# Altium schematic sheet FPGA1.SchDoc: Cypress Molson - FPGA1
size C; DrawnBy: G. Cosens; Engineer: G. Cosens; Organization: Linear Systems Ltd.; Address1: 1-1717 Dublin Ave.; Address2: Winnipeg, MB, Canada; Address3: R3H 0H2; DocumentNumber: LS7652; Revision: 1; SheetNumber: 04; SheetTotal: 12
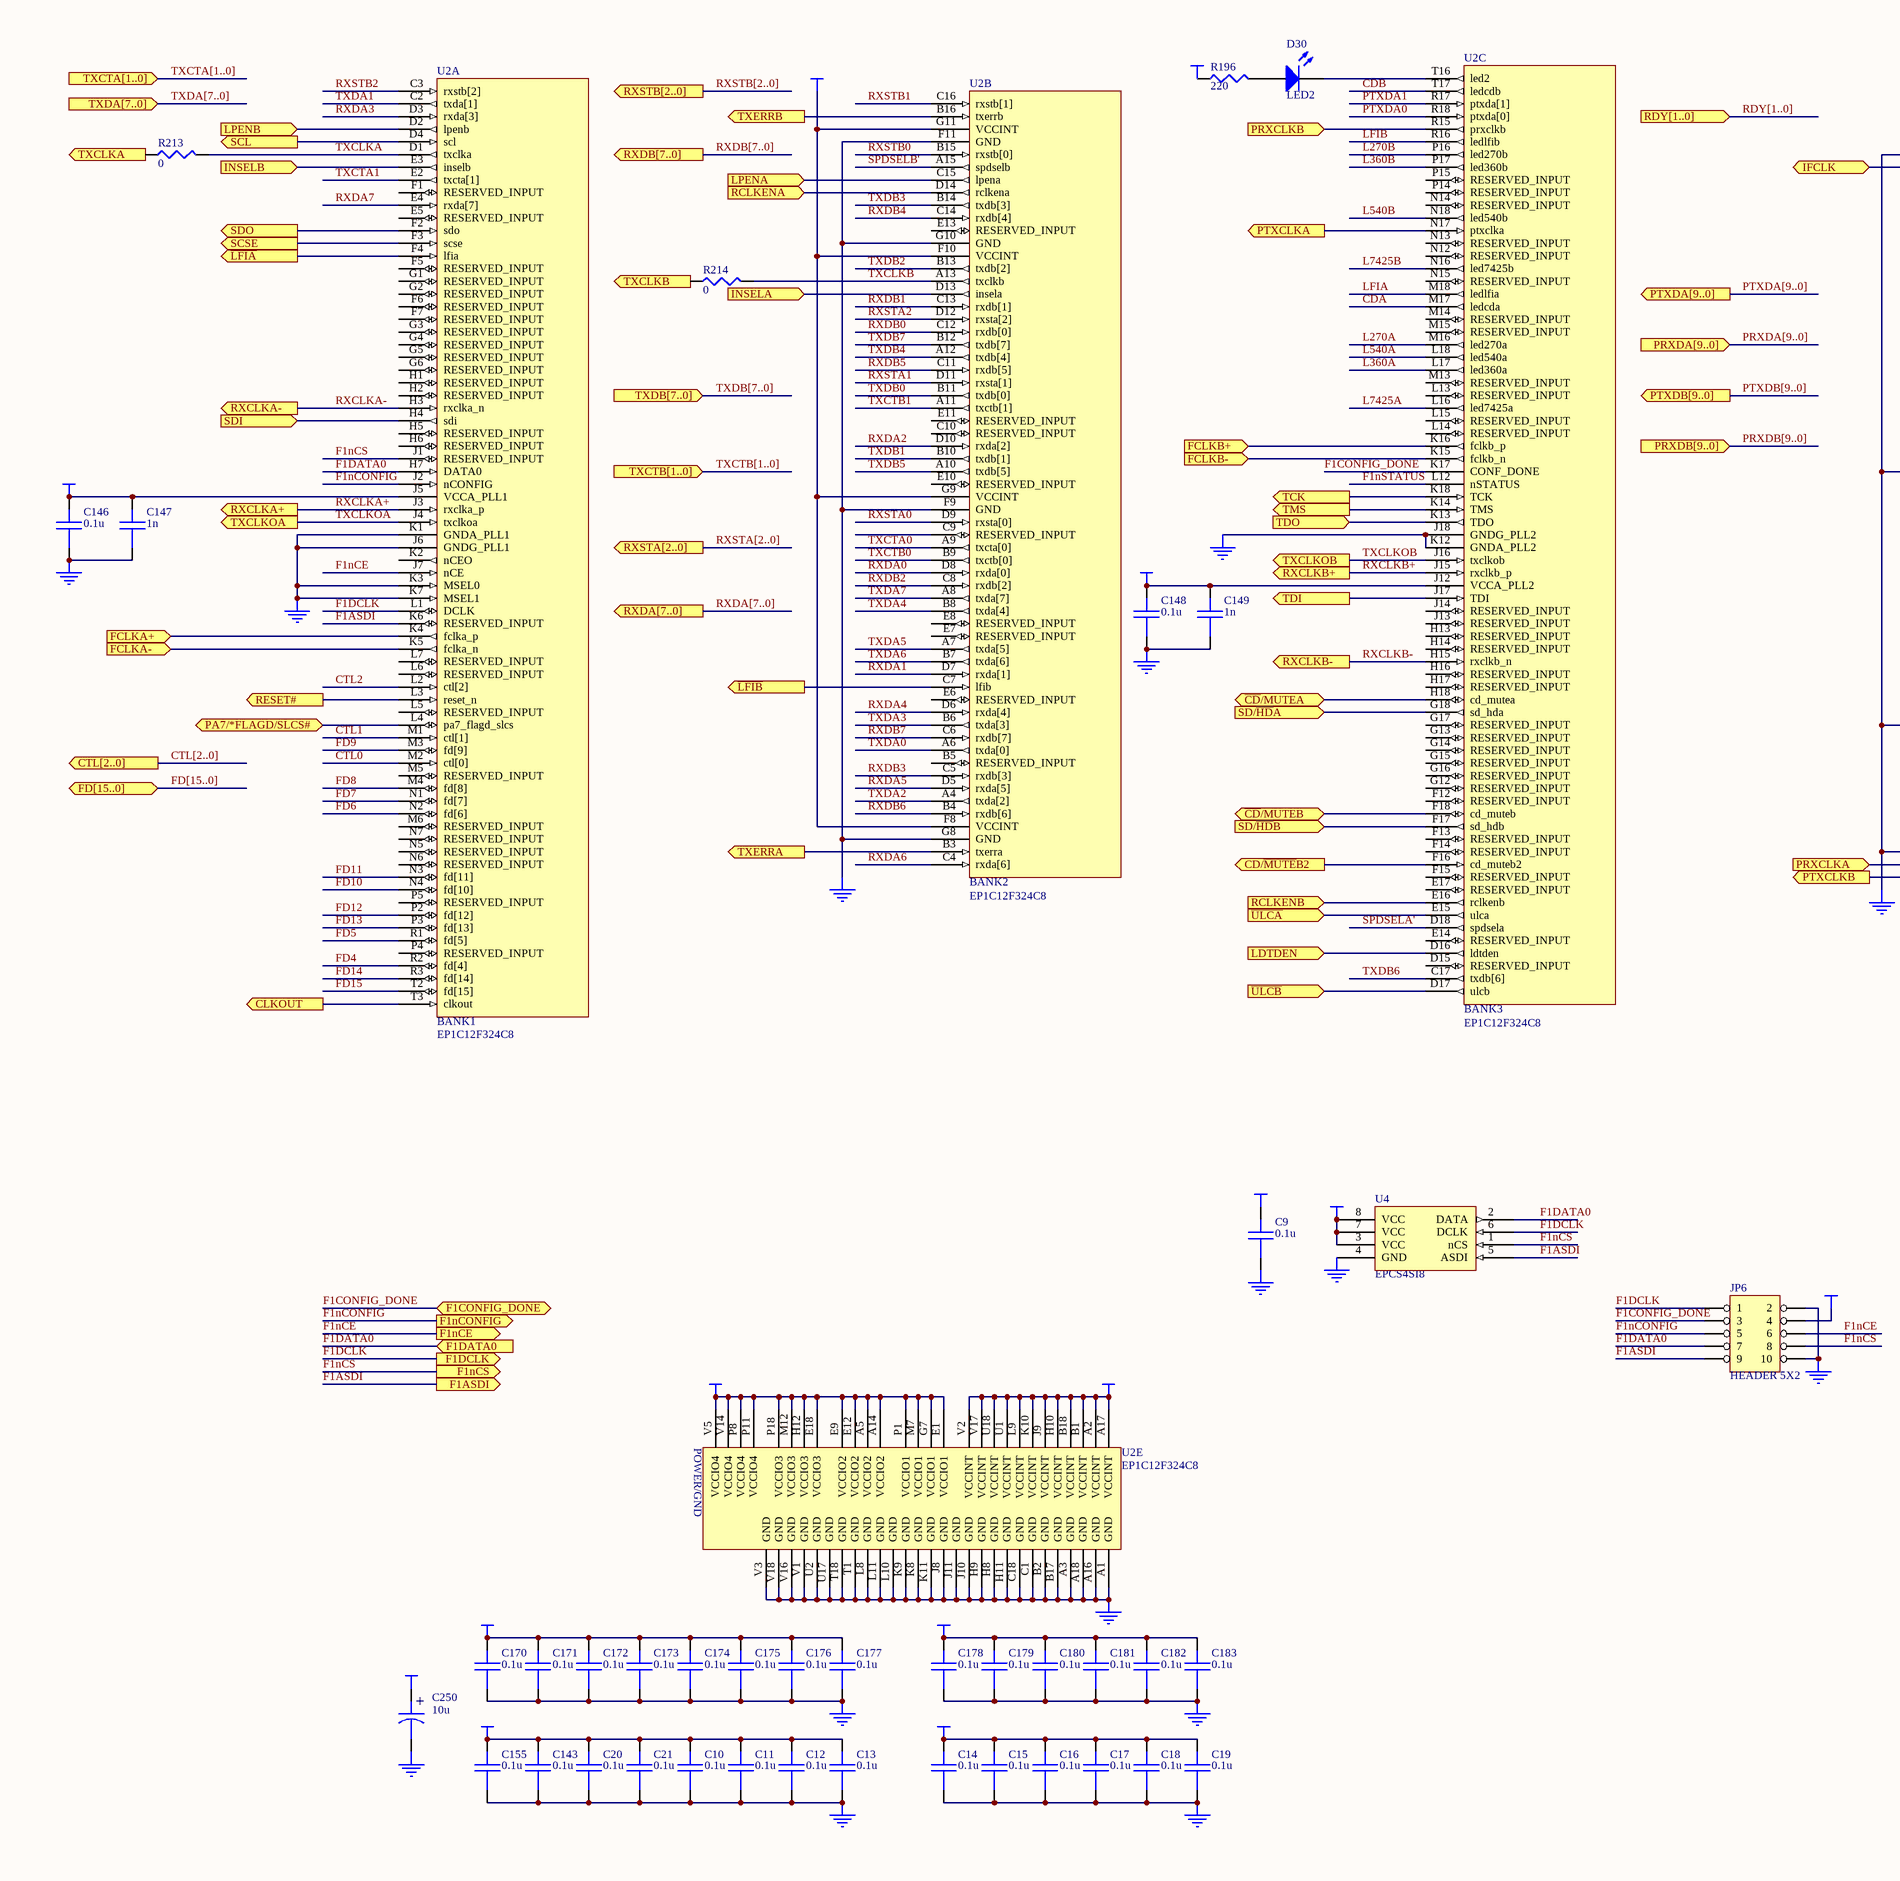
[diagram p0: FPGA1.SchDoc, left]
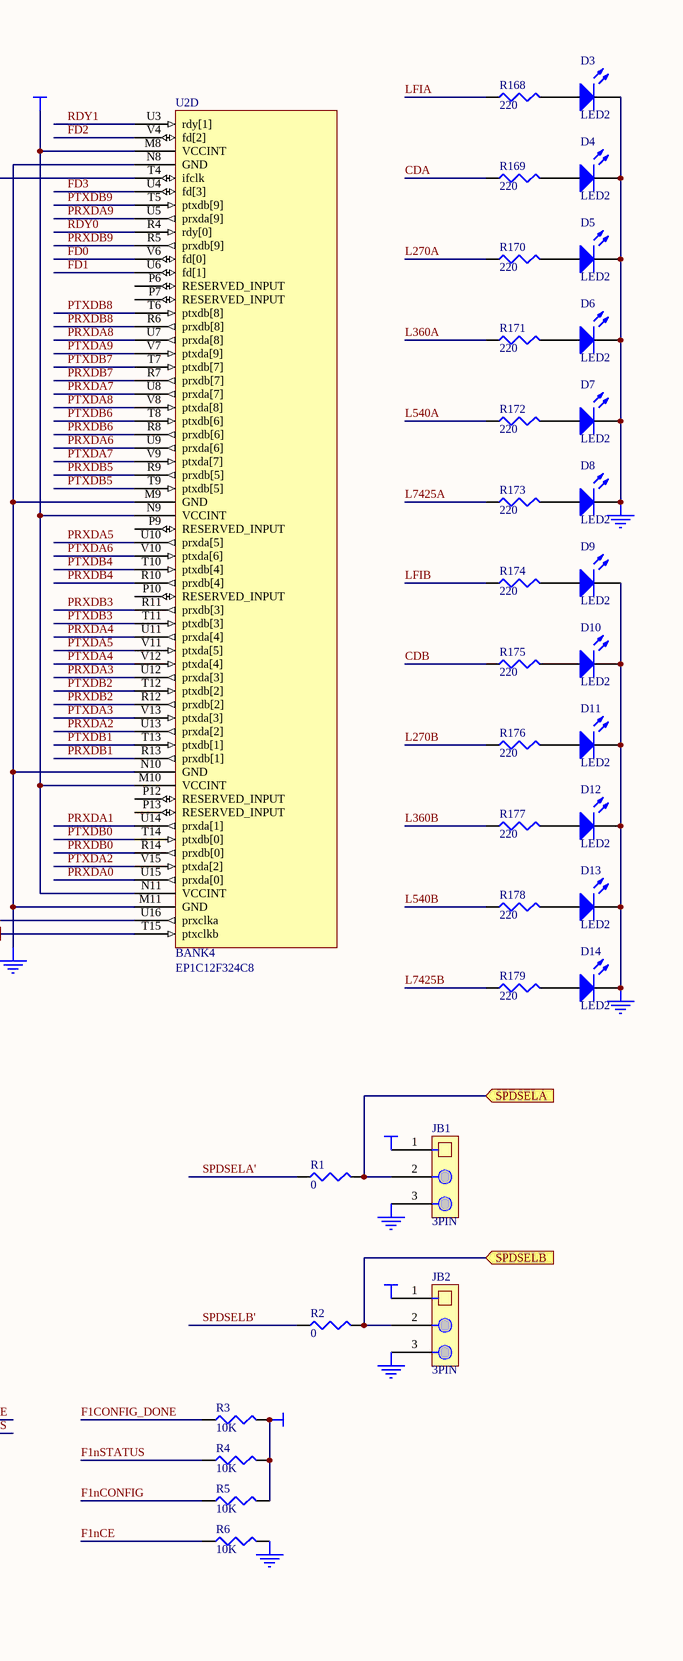
[diagram p1: FPGA1.SchDoc, right]

## Parts
C9  (no value)  [0603]
C10  (no value)  [0603]
C11  (no value)  [0603]
C12  (no value)  [0603]
C13  (no value)  [0603]
C14  (no value)  [0603]
C15  (no value)  [0603]
C16  (no value)  [0603]
C17  (no value)  [0603]
C18  (no value)  [0603]
C19  (no value)  [0603]
C20  (no value)  [0603]
C21  (no value)  [0603]
C143  (no value)  [0603]
C146  (no value)  [0603]
C147  (no value)  [0603]
C148  (no value)  [0603]
C149  (no value)  [0603]
C155  (no value)  [0603]
C170  (no value)  [0603]
C171  (no value)  [0603]
C172  (no value)  [0603]
C173  (no value)  [0603]
C174  (no value)  [0603]
C175  (no value)  [0603]
C176  (no value)  [0603]
C177  (no value)  [0603]
C178  (no value)  [0603]
C179  (no value)  [0603]
C180  (no value)  [0603]
C181  (no value)  [0603]
C182  (no value)  [0603]
C183  (no value)  [0603]
C250  10u  [6032]
D3  LED2  [0603D]
D4  LED2  [0603D]
D5  LED2  [0603D]
D6  LED2  [0603D]
D7  LED2  [0603D]
D8  LED2  [0603D]
D9  LED2  [0603D]
D10  LED2  [0603D]
D11  LED2  [0603D]
D12  LED2  [0603D]
D13  LED2  [0603D]
D14  LED2  [0603D]
D30  LED2  [0603D]
JB1  3PIN  [3X1PIN]
JB2  3PIN  [3X1PIN]
JP6  (no value)  [2X5PIN]
R1  0  [0603]
R2  0  [0603]
R3  10K  [0603]
R4  10K  [0603]
R5  10K  [0603]
R6  10K  [0603]
R168  220  [0603]
R169  220  [0603]
R170  220  [0603]
R171  220  [0603]
R172  220  [0603]
R173  220  [0603]
R174  220  [0603]
R175  220  [0603]
R176  220  [0603]
R177  220  [0603]
R178  220  [0603]
R179  220  [0603]
R196  220  [0603]
R213  0  [0603]
R214  0  [0603]
U2  EP1C12F324C8  [BGA19X19-B324]  (parts A,B,C,D,E of 5)
U4  (no value)  [SO-8]

## Ports
CD/~{MUTE}B2 (out), CLKOUT (out), CTL[2..0] (out), F1ASDI (out), F1CONFIG_DONE (bidir), F1DATA0 (in), F1DCLK (out), F1nCE (out), F1nCONFIG (out), F1nCS (out), FCLKA+ (in), FCLKA- (in), FCLKB+ (in), FCLKB- (in), FD[15..0] (bidir), IFCLK (bidir), INSELA (in), INSELB (in), LDTDEN (in), LPENA (in), LPENB (in), PA7/*FLAGD/SLCS# (bidir), PRXCLKA (in), PRXCLKB (in), PRXDA[9..0] (in), PRXDB[9..0] (in), PTXCLKA (out), PTXCLKB (out), PTXDA[9..0] (out), PTXDB[9..0] (out), RCLKENA (in), RCLKENB (in), RDY[1..0] (in), RESET# (out), RXCLKA+ (out), RXCLKA- (out), RXCLKB+ (out), RXCLKB- (out), RXDA[7..0] (out), RXDB[7..0] (out), RXSTA[2..0] (out), RXSTB[2..0] (out), SCL (out), SCSE (out), SD/~{HD}A (in), SD/~{HD}B (in), SDI (in), SDO (out), SPDSELA (in), SPDSELB (in), TCK (out), TDI (out), TDO (in), TMS (out), TXCLKA (in), TXCLKB (in), TXCLKOA (out), TXCLKOB (out), TXCTA[1..0] (in), TXCTB[1..0] (in), TXDA[7..0] (in), TXDB[7..0] (in), TXERRA (out), TXERRB (out), ~{CD}/MUTEA (bidir), ~{CD}/MUTEB (bidir), ~{LFIA} (out), ~{LFIB} (out), ~{ULCA} (in), ~{ULCB} (in)

## Nets
+1.5V: C14.1 C15.1 C16.1 C17.1 C18.1 C19.1 C178.1 C179.1 C180.1 C181.1 C182.1 C183.1 U2.A2(VCCINT) U2.A17(VCCINT) U2.B1(VCCINT) U2.B18(VCCINT) U2.F8(VCCINT) U2.F10(VCCINT) U2.G9(VCCINT) U2.G11(VCCINT) U2.H10(VCCINT) U2.J9(VCCINT) U2.K10(VCCINT) U2.L9(VCCINT) U2.M8(VCCINT) U2.M10(VCCINT) U2.N9(VCCINT) U2.N11(VCCINT) U2.U1(VCCINT) U2.U18(VCCINT) U2.V2(VCCINT) U2.V17(VCCINT)
+1.5VA: C146.1 C147.1 C148.1 C149.1 U2.J5(VCCA_PLL1) U2.J12(VCCA_PLL2)
+3.3V: C9.1 C10.1 C11.1 C12.1 C13.1 C20.1 C21.1 C143.1 C155.1 C170.1 C171.1 C172.1 C173.1 C174.1 C175.1 C176.1 C177.1 C250.1 JB1.1 JB2.1 JP6.4 R3.2 R4.2 R5.2 R196.1 U2.A5(VCCIO2) U2.A14(VCCIO2) U2.E1(VCCIO1) U2.E9(VCCIO2) U2.E12(VCCIO2) U2.E18(VCCIO3) U2.G7(VCCIO1) U2.H12(VCCIO3) U2.M7(VCCIO1) U2.M12(VCCIO3) U2.P1(VCCIO1) U2.P8(VCCIO4) U2.P11(VCCIO4) U2.P18(VCCIO3) U2.V5(VCCIO4) U2.V14(VCCIO4) U4.3(VCC) U4.7(VCC) U4.8(VCC)
GND: C9.2 C10.2 C11.2 C12.2 C13.2 C14.2 C15.2 C16.2 C17.2 C18.2 C19.2 C20.2 C21.2 C143.2 C146.2 C147.2 C148.2 C149.2 C155.2 C170.2 C171.2 C172.2 C173.2 C174.2 C175.2 C176.2 C177.2 C178.2 C179.2 C180.2 C181.2 C182.2 C183.2 C250.2 D3.2(K) D4.2(K) D5.2(K) D6.2(K) D7.2(K) D8.2(K) D9.2(K) D10.2(K) D11.2(K) D12.2(K) D13.2(K) D14.2(K) JB1.3 JB2.3 JP6.2 JP6.10 R6.2 U2.A1(GND) U2.A3(GND) U2.A16(GND) U2.A18(GND) U2.B2(GND) U2.B17(GND) U2.C1(GND) U2.C18(GND) U2.F9(GND) U2.F11(GND) U2.G8(GND) U2.G10(GND) U2.H8(GND) U2.H9(GND) U2.H11(GND) U2.J6(GNDG_PLL1) U2.J8(GND) U2.J10(GND) U2.J11(GND) U2.J18(GNDG_PLL2) U2.K1(GNDA_PLL1) U2.K3(MSEL0) U2.K7(MSEL1) U2.K8(GND) U2.K9(GND) U2.K11(GND) U2.K12(GNDA_PLL2) U2.L8(GND) U2.L10(GND) U2.L11(GND) U2.M9(GND) U2.M11(GND) U2.N8(GND) U2.N10(GND) U2.T1(GND) U2.T18(GND) U2.U2(GND) U2.U17(GND) U2.V1(GND) U2.V3(GND) U2.V16(GND) U2.V18(GND) U4.4(GND)
~{CD}/MUTEA: U2.H18(cd_mutea) ; port ~{CD}/MUTEA
~{CD}/MUTEB: U2.F18(cd_muteb) ; port ~{CD}/MUTEB
CD/~{MUTE}B2: U2.F16(cd_muteb2) ; port CD/~{MUTE}B2
CDA: R169.1 U2.M17(ledcda)
CDB: R175.1 U2.T17(ledcdb)
CLKOUT: U2.T3(clkout) ; port CLKOUT
CTL0: U2.M2(ctl[0])
CTL1: U2.M1(ctl[1])
CTL2: U2.L2(ctl[2])
F1ASDI: JP6.9 U2.K6(RESERVED_INPUT) U4.5(ASDI) ; port F1ASDI
F1CONFIG_DONE: JP6.3 R3.1 U2.K17(CONF_DONE) ; port F1CONFIG_DONE
F1DATA0: JP6.7 U2.H7(DATA0) U4.2(DATA) ; port F1DATA0
F1DCLK: JP6.1 U2.L1(DCLK) U4.6(DCLK) ; port F1DCLK
F1nCE: JP6.6 R6.1 U2.J7(nCE) ; port F1nCE
F1nCONFIG: JP6.5 R5.1 U2.J2(nCONFIG) ; port F1nCONFIG
F1nCS: JP6.8 U2.J1(RESERVED_INPUT) U4.1(nCS) ; port F1nCS
F1nSTATUS: R4.1 U2.L12(nSTATUS)
FCLKA+: U2.K4(fclka_p) ; port FCLKA+
FCLKA-: U2.K5(fclka_n) ; port FCLKA-
FCLKB+: U2.K16(fclkb_p) ; port FCLKB+
FCLKB-: U2.K15(fclkb_n) ; port FCLKB-
FD0: U2.V6(fd[0])
FD1: U2.U6(fd[1])
FD2: U2.V4(fd[2])
FD3: U2.U4(fd[3])
FD4: U2.R2(fd[4])
FD5: U2.R1(fd[5])
FD6: U2.N2(fd[6])
FD7: U2.N1(fd[7])
FD8: U2.M4(fd[8])
FD9: U2.M3(fd[9])
FD10: U2.N4(fd[10])
FD11: U2.N3(fd[11])
FD12: U2.P2(fd[12])
FD13: U2.P3(fd[13])
FD14: U2.R3(fd[14])
FD15: U2.T2(fd[15])
IFCLK: U2.T4(ifclk) ; port IFCLK
INSELA: U2.D13(insela) ; port INSELA
INSELB: U2.E3(inselb) ; port INSELB
L270A: R170.1 U2.M16(led270a)
L270B: R176.1 U2.P16(led270b)
L360A: R171.1 U2.L17(led360a)
L360B: R177.1 U2.P17(led360b)
L540A: R172.1 U2.L18(led540a)
L540B: R178.1 U2.N18(led540b)
L7425A: R173.1 U2.L16(led7425a)
L7425B: R179.1 U2.N16(led7425b)
~{LFIA}: U2.F4(lfia) ; port ~{LFIA}
~{LFIB}: U2.C7(lfib) ; port ~{LFIB}
LDTDEN: U2.D16(ldtden) ; port LDTDEN
LFIA: R168.1 U2.M18(ledlfia)
LFIB: R174.1 U2.R16(ledlfib)
LPENA: U2.C15(lpena) ; port LPENA
LPENB: U2.D2(lpenb) ; port LPENB
PA7/*FLAGD/SLCS#: U2.L4(pa7_flagd_slcs) ; port PA7/*FLAGD/SLCS#
PRXCLKA: U2.U16(prxclka) ; port PRXCLKA
PRXCLKB: U2.R15(prxclkb) ; port PRXCLKB
PRXDA0: U2.U15(prxda[0])
PRXDA1: U2.U14(prxda[1])
PRXDA2: U2.U13(prxda[2])
PRXDA3: U2.U12(prxda[3])
PRXDA4: U2.U11(prxda[4])
PRXDA5: U2.U10(prxda[5])
PRXDA6: U2.U9(prxda[6])
PRXDA7: U2.U8(prxda[7])
PRXDA8: U2.U7(prxda[8])
PRXDA9: U2.U5(prxda[9])
PRXDB0: U2.R14(prxdb[0])
PRXDB1: U2.R13(prxdb[1])
PRXDB2: U2.R12(prxdb[2])
PRXDB3: U2.R11(prxdb[3])
PRXDB4: U2.R10(prxdb[4])
PRXDB5: U2.R9(prxdb[5])
PRXDB6: U2.R8(prxdb[6])
PRXDB7: U2.R7(prxdb[7])
PRXDB8: U2.R6(prxdb[8])
PRXDB9: U2.R5(prxdb[9])
PTXCLKA: U2.N17(ptxclka) ; port PTXCLKA
PTXCLKB: U2.T15(ptxclkb) ; port PTXCLKB
PTXDA0: U2.R18(ptxda[0])
PTXDA1: U2.R17(ptxda[1])
PTXDA2: U2.V15(ptxda[2])
PTXDA3: U2.V13(ptxda[3])
PTXDA4: U2.V12(ptxda[4])
PTXDA5: U2.V11(ptxda[5])
PTXDA6: U2.V10(ptxda[6])
PTXDA7: U2.V9(ptxda[7])
PTXDA8: U2.V8(ptxda[8])
PTXDA9: U2.V7(ptxda[9])
PTXDB0: U2.T14(ptxdb[0])
PTXDB1: U2.T13(ptxdb[1])
PTXDB2: U2.T12(ptxdb[2])
PTXDB3: U2.T11(ptxdb[3])
PTXDB4: U2.T10(ptxdb[4])
PTXDB5: U2.T9(ptxdb[5])
PTXDB6: U2.T8(ptxdb[6])
PTXDB7: U2.T7(ptxdb[7])
PTXDB8: U2.T6(ptxdb[8])
PTXDB9: U2.T5(ptxdb[9])
RCLKENA: U2.D14(rclkena) ; port RCLKENA
RCLKENB: U2.E16(rclkenb) ; port RCLKENB
RDY0: U2.R4(rdy[0])
RDY1: U2.U3(rdy[1])
RESET#: U2.L3(reset_n) ; port RESET#
RXCLKA+: U2.J3(rxclka_p) ; port RXCLKA+
RXCLKA-: U2.H3(rxclka_n) ; port RXCLKA-
RXCLKB+: U2.J15(rxclkb_p) ; port RXCLKB+
RXCLKB-: U2.H15(rxclkb_n) ; port RXCLKB-
RXDA0: U2.D8(rxda[0])
RXDA1: U2.D7(rxda[1])
RXDA2: U2.D10(rxda[2])
RXDA3: U2.D3(rxda[3])
RXDA4: U2.D6(rxda[4])
RXDA5: U2.D5(rxda[5])
RXDA6: U2.C4(rxda[6])
RXDA7: U2.E4(rxda[7])
RXDB0: U2.C12(rxdb[0])
RXDB1: U2.C13(rxdb[1])
RXDB2: U2.C8(rxdb[2])
RXDB3: U2.C5(rxdb[3])
RXDB4: U2.C14(rxdb[4])
RXDB5: U2.C11(rxdb[5])
RXDB6: U2.B4(rxdb[6])
RXDB7: U2.C6(rxdb[7])
RXSTA0: U2.D9(rxsta[0])
RXSTA1: U2.D11(rxsta[1])
RXSTA2: U2.D12(rxsta[2])
RXSTB0: U2.B15(rxstb[0])
RXSTB1: U2.C16(rxstb[1])
RXSTB2: U2.C3(rxstb[2])
SCL: U2.D4(scl) ; port SCL
SCSE: U2.F3(scse) ; port SCSE
SD/~{HD}A: U2.G18(sd_hda) ; port SD/~{HD}A
SD/~{HD}B: U2.F17(sd_hdb) ; port SD/~{HD}B
SDI: U2.H4(sdi) ; port SDI
SDO: U2.F2(sdo) ; port SDO
SPDSELA: JB1.2 R1.2 ; port SPDSELA
SPDSELA': R1.1 U2.D18(spdsela)
SPDSELB: JB2.2 R2.2 ; port SPDSELB
SPDSELB': R2.1 U2.A15(spdselb)
TCK: U2.K18(TCK) ; port TCK
TDI: U2.J17(TDI) ; port TDI
TDO: U2.K13(TDO) ; port TDO
TMS: U2.K14(TMS) ; port TMS
TXCLKA: R213.1 ; port TXCLKA
TXCLKA: R213.2 U2.D1(txclka)  [a separate net that carries the same name]
TXCLKB: R214.1 ; port TXCLKB
TXCLKB: R214.2 U2.A13(txclkb)  [a separate net that carries the same name]
TXCLKOA: U2.J4(txclkoa) ; port TXCLKOA
TXCLKOB: U2.J16(txclkob) ; port TXCLKOB
TXCTA0: U2.A9(txcta[0])
TXCTA1: U2.E2(txcta[1])
TXCTB0: U2.B9(txctb[0])
TXCTB1: U2.A11(txctb[1])
TXDA0: U2.A6(txda[0])
TXDA1: U2.C2(txda[1])
TXDA2: U2.A4(txda[2])
TXDA3: U2.B6(txda[3])
TXDA4: U2.B8(txda[4])
TXDA5: U2.A7(txda[5])
TXDA6: U2.B7(txda[6])
TXDA7: U2.A8(txda[7])
TXDB0: U2.B11(txdb[0])
TXDB1: U2.B10(txdb[1])
TXDB2: U2.B13(txdb[2])
TXDB3: U2.B14(txdb[3])
TXDB4: U2.A12(txdb[4])
TXDB5: U2.A10(txdb[5])
TXDB6: U2.C17(txdb[6])
TXDB7: U2.B12(txdb[7])
TXERRA: U2.B3(txerra) ; port TXERRA
TXERRB: U2.B16(txerrb) ; port TXERRB
~{ULCA}: U2.E15(ulca) ; port ~{ULCA}
~{ULCB}: U2.D17(ulcb) ; port ~{ULCB}
NetD3_1: D3.1(A) R168.2
NetD4_1: D4.1(A) R169.2
NetD5_1: D5.1(A) R170.2
NetD6_1: D6.1(A) R171.2
NetD7_1: D7.1(A) R172.2
NetD8_1: D8.1(A) R173.2
NetD9_1: D9.1(A) R174.2
NetD10_1: D10.1(A) R175.2
NetD11_1: D11.1(A) R176.2
NetD12_1: D12.1(A) R177.2
NetD13_1: D13.1(A) R178.2
NetD14_1: D14.1(A) R179.2
NetD30_1: D30.1(A) R196.2
NetD30_2: D30.2(K) U2.T16(led2)

Not connected (* = marked no-connect by the designer): U2 B5(RESERVED_INPUT) C9(RESERVED_INPUT) C10(RESERVED_INPUT) D15(RESERVED_INPUT) E5(RESERVED_INPUT) E6(RESERVED_INPUT) E7(RESERVED_INPUT) E8(RESERVED_INPUT) E10(RESERVED_INPUT) E11(RESERVED_INPUT) E13(RESERVED_INPUT) E14(RESERVED_INPUT) E17(RESERVED_INPUT) F1(RESERVED_INPUT) F5(RESERVED_INPUT) F6(RESERVED_INPUT) F7(RESERVED_INPUT) F12(RESERVED_INPUT) F13(RESERVED_INPUT) F14(RESERVED_INPUT) F15(RESERVED_INPUT) G1(RESERVED_INPUT) G2(RESERVED_INPUT) G3(RESERVED_INPUT) G4(RESERVED_INPUT) G5(RESERVED_INPUT) G6(RESERVED_INPUT) G12(RESERVED_INPUT) G13(RESERVED_INPUT) G14(RESERVED_INPUT) G15(RESERVED_INPUT) G16(RESERVED_INPUT) G17(RESERVED_INPUT) H1(RESERVED_INPUT) H2(RESERVED_INPUT) H5(RESERVED_INPUT) H6(RESERVED_INPUT) H13(RESERVED_INPUT) H14(RESERVED_INPUT) H16(RESERVED_INPUT) H17(RESERVED_INPUT) J13(RESERVED_INPUT) J14(RESERVED_INPUT) K2(nCEO) L5(RESERVED_INPUT) L6(RESERVED_INPUT) L7(RESERVED_INPUT) L13(RESERVED_INPUT) L14(RESERVED_INPUT) L15(RESERVED_INPUT) M5(RESERVED_INPUT) M6(RESERVED_INPUT) M13(RESERVED_INPUT) M14(RESERVED_INPUT) M15(RESERVED_INPUT) N5(RESERVED_INPUT) N6(RESERVED_INPUT) N7(RESERVED_INPUT) N12(RESERVED_INPUT) N13(RESERVED_INPUT) N14(RESERVED_INPUT) N15(RESERVED_INPUT) P4(RESERVED_INPUT) P5(RESERVED_INPUT) P6(RESERVED_INPUT) P7(RESERVED_INPUT) P9(RESERVED_INPUT) P10(RESERVED_INPUT) P12(RESERVED_INPUT) P13(RESERVED_INPUT) P14(RESERVED_INPUT) P15(RESERVED_INPUT)

## Buses and harness runs
bus CTL[2..0] = port CTL[2..0]
bus FD[15..0] = port FD[15..0]
bus PRXDA[9..0] = port PRXDA[9..0]
bus PRXDB[9..0] = port PRXDB[9..0]
bus PTXDA[9..0] = port PTXDA[9..0]
bus PTXDB[9..0] = port PTXDB[9..0]
bus RDY[1..0] = port RDY[1..0]
bus RXDA[7..0] = port RXDA[7..0]
bus RXDB[7..0] = port RXDB[7..0]
bus RXSTA[2..0] = port RXSTA[2..0]
bus RXSTB[2..0] = port RXSTB[2..0]
bus TXCTA[1..0] = port TXCTA[1..0]
bus TXCTB[1..0] = port TXCTB[1..0]
bus TXDA[7..0] = port TXDA[7..0]
bus TXDB[7..0] = port TXDB[7..0]

## Notes on the sheet
- Size
- Date:
- File:
- B
- Drawing Number
- Sheet
- Drawn By:
- G. Cosens
- Revision
- of
- (in symbol CAPACITOR POL) +
- (in symbol EP1C12F324C8_1, part A) BANK1
- (in symbol EP1C12F324C8_1, part B) BANK2
- (in symbol EP1C12F324C8_1, part C) BANK3
- (in symbol EP1C12F324C8_1, part D) BANK4
- (in symbol EP1C12F324C8_1, part E) POWER/GND

## Library data of the parts
C9-C21 C143 C146-C149 C155 C170-C183 = CAP: SMT CAP
C250 = CAPACITOR POL: Text Field1: 20; Text Field2: 20
D3-D14 D30 = LED2: Typical RED, GREEN, YELLOW, AMBER GaAs LED; Manufacturer: Generic Components; Class I: Optoelectronic; Published: 8-Jun-2000; Revision: July-2002: Re-released for DXP Platform.; Publisher: Altium Limited; Class II: LED
JB1 JB2 = 3PIN: 3X1PIN
JP6 = HEADER 5X2: Text Field1: 40; Text Field2: 60
R1-R6 R168-R179 R196 R213 R214 = RES1
U2 = EP1C12F324C8_1
U4 = EPCS4SI8